# Altium schematic sheet LM2587_12v.SchDoc
size Letter
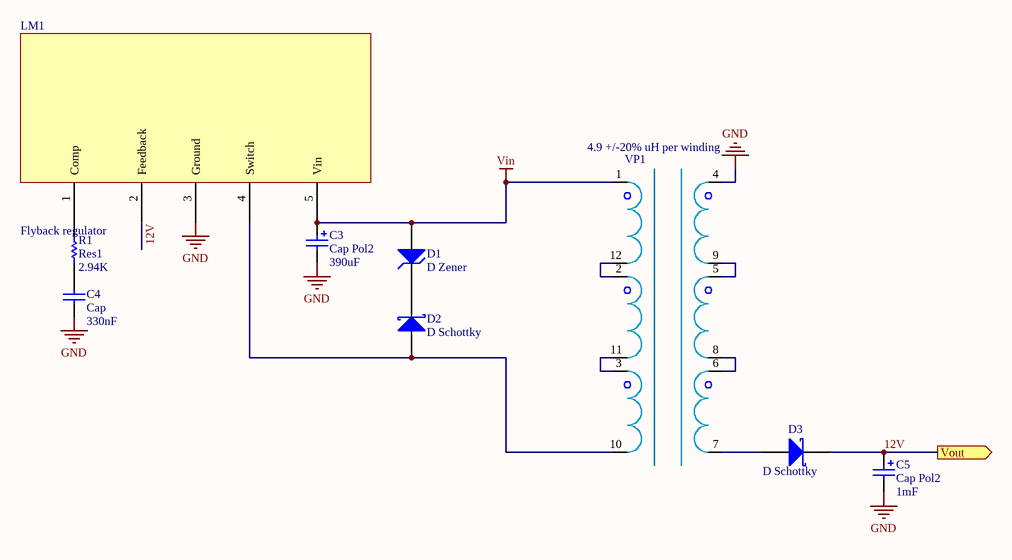
[diagram p0: LM2587_12v.SchDoc]

## Parts
C3  Cap Pol2  value 390uF  [AXIAL-0.3]
C4  Cap  value 330nF  [AXIAL-0.3]
C5  Cap Pol2  value 1mF  [AXIAL-0.3]
D1  D Zener  [DIODE]
D2  D Schottky  [DIODE]
D3  D Schottky  [DIODE]
LM1  Flyback regulator  [TS5B]
R1  Res1  value 2.94K  [AXIAL-0.3]
VP1  4.9 +/-20% uH per winding  [TRANSFORMER_SOP12]

## Ports
Vout (out)

## Nets
GND: C3.2 C4.1 C5.2 LM1.3(Ground) VP1.4
Vin: C3.1 D1.1(A) LM1.5(Vin) VP1.1
12V: C5.1 D3.2(K) LM1.2(Feedback) ; port Vout
NetC4_2: C4.2 R1.1
NetD1_2: D1.2(K) D2.2(K)
NetD2_1: D2.1(A) LM1.4(Switch) VP1.10
NetD3_1: D3.1(A) VP1.7
NetLM1_1: LM1.1(Comp) R1.2
NetVP1_2: VP1.2 VP1.12
NetVP1_3: VP1.3 VP1.11
NetVP1_5: VP1.5 VP1.9
NetVP1_6: VP1.6 VP1.8

## Library data of the parts
C3 C5 = Cap Pol2: Polarized Capacitor (Axial); Published: 8-Jun-2000; LatestRevisionDate: 17-Jul-2002; LatestRevisionNote: Re-released for DXP Platform.; PackageReference: POLAR0.8; Publisher: Altium Limited; PackageDescription: Polarized Capacitor; 2 Leads
C4 = Cap: Capacitor; Published: 8-Jun-2000; LatestRevisionDate: 17-Jul-2002; LatestRevisionNote: Re-released for DXP Platform.; PackageReference: RAD-0.3; Publisher: Altium Limited; PackageDescription: Radial Cap, Thru-Hole; 2 Leads; 0.3 in Pin Spacing
D1 = D Zener: Zener Diode; Published: 8-Jun-2000; LatestRevisionDate: 17-Jul-2002; LatestRevisionNote: Re-released for DXP Platform.; PackageReference: DIODE-0.7; Publisher: Altium Limited; PackageDescription: Diode, Thru-Hole; 2 Leads; 0.7 in Pin Spacing
D2 D3 = D Schottky: Schottky Diode; Published: 8-Jun-2000; LatestRevisionDate: 17-Jul-2002; LatestRevisionNote: Re-released for DXP Platform.; PackageReference: SMB; Publisher: Altium Limited; PackageDescription: DO-214-AA/SMB; 2 C-Bend Leads; Body 5.3 x 3.6 mm, inc. leads (LxW); Code_JEDEC: DO-214-AA
LM1 = LM2587
R1 = Res1: Resistor; Published: 8-Jun-2000; LatestRevisionDate: 17-Jul-2002; LatestRevisionNote: Re-released for DXP Platform.; PackageReference: AXIAL-0.3; Publisher: Altium Limited; PackageDescription: Axial Device, Thru-Hole; 2 Leads; 0.3 in Pin Spacing
VP1 = VP4-0060-R